# EAGLE design Logic Probe Ver.1 (EAGLE 9.6.2)
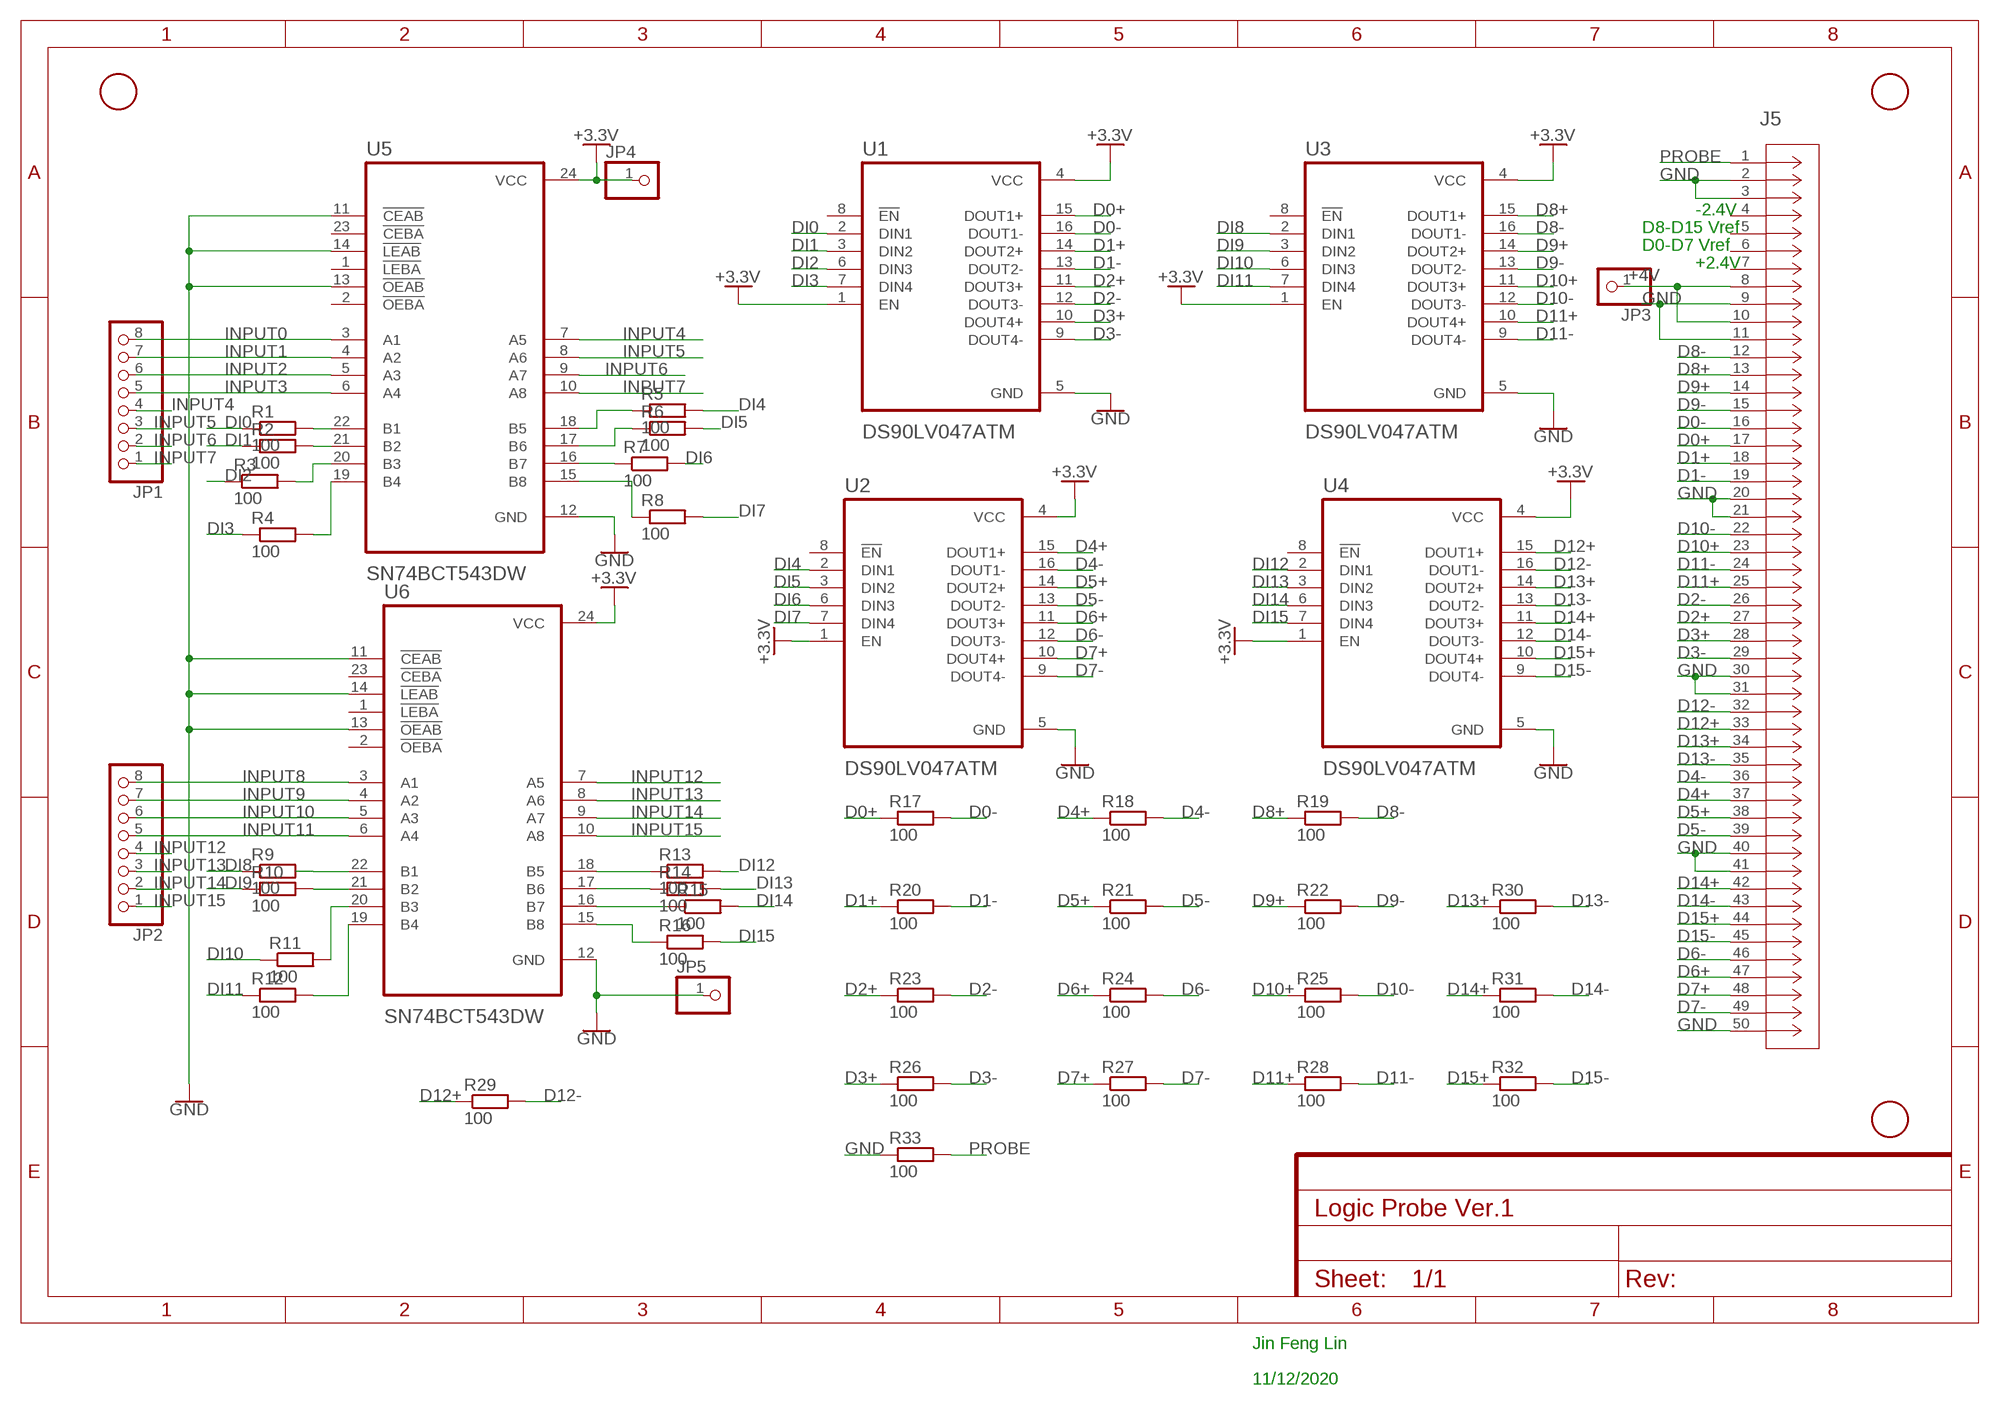
[diagram p0: schematic, sheet 1]

## Parts
J5  TST-125-01-G-D  [CONN_TST-125-XX-X-D_SAI]
JP1  PINHD-1X8LOCK  [1X08-LOCK]
JP2  PINHD-1X8LOCK  [1X08-LOCK]
JP3  PINHD-1X1  [1X01]
JP4  PINHD-1X1  [1X01]
JP5  PINHD-1X1  [1X01]
R1  100  R-EU_R0805  [R0805]
R2  100  R-EU_R0805  [R0805]
R3  100  R-EU_R0805  [R0805]
R4  100  R-EU_R0805  [R0805]
R5  100  R-EU_R0805  [R0805]
R6  100  R-EU_R0805  [R0805]
R7  100  R-EU_R0805  [R0805]
R8  100  R-EU_R0805  [R0805]
R9  100  R-EU_R0805  [R0805]
R10  100  R-EU_R0805  [R0805]
R11  100  R-EU_R0805  [R0805]
R12  100  R-EU_R0805  [R0805]
R13  100  R-EU_R0805  [R0805]
R14  100  R-EU_R0805  [R0805]
R15  100  R-EU_R0805  [R0805]
R16  100  R-EU_R0805  [R0805]
R17  100  R-EU_R0805  [R0805]
R18  100  R-EU_R0805  [R0805]
R19  100  R-EU_R0805  [R0805]
R20  100  R-EU_R0805  [R0805]
R21  100  R-EU_R0805  [R0805]
R22  100  R-EU_R0805  [R0805]
R23  100  R-EU_R0805  [R0805]
R24  100  R-EU_R0805  [R0805]
R25  100  R-EU_R0805  [R0805]
R26  100  R-EU_R0805  [R0805]
R27  100  R-EU_R0805  [R0805]
R28  100  R-EU_R0805  [R0805]
R29  100  R-EU_R0805  [R0805]
R30  100  R-EU_R0805  [R0805]
R31  100  R-EU_R0805  [R0805]
R32  100  R-EU_R0805  [R0805]
R33  100  R-EU_R0805  [R0805]
U1  DS90LV047ATM  [SOIC127P600X175-16N]
U2  DS90LV047ATM  [SOIC127P600X175-16N]
U3  DS90LV047ATM  [SOIC127P600X175-16N]
U4  DS90LV047ATM  [SOIC127P600X175-16N]
U5  SN74BCT543DW  [SOIC127P1030X265-24N]
U6  SN74BCT543DW  [SOIC127P1030X265-24N]
U$1  FIDUCIAL  [FIDUCIAL_1MM]
U$2  FIDUCIAL  [FIDUCIAL_1MM]
U$3  FIDUCIAL  [FIDUCIAL_1MM]

## Nets
+3.3V: JP4.1 U1.1(EN) U1.4(VCC) U2.1(EN) U2.4(VCC) U3.1(EN) U3.4(VCC) U4.1(EN) U4.4(VCC) U5.24(VCC) U6.24(VCC)
+4V: J5.8 J5.10 JP3.1
D0+: J5.17 R17.1 U1.15(DOUT1+)
D0-: J5.16 R17.2 U1.16(DOUT1-)
D1+: J5.18 R20.1 U1.14(DOUT2+)
D1-: J5.19 R20.2 U1.13(DOUT2-)
D2+: J5.27 R23.1 U1.11(DOUT3+)
D2-: J5.26 R23.2 U1.12(DOUT3-)
D3+: J5.28 R26.1 U1.10(DOUT4+)
D3-: J5.29 R26.2 U1.9(DOUT4-)
D4+: J5.37 R18.1 U2.15(DOUT1+)
D4-: J5.36 R18.2 U2.16(DOUT1-)
D5+: J5.38 R21.1 U2.14(DOUT2+)
D5-: J5.39 R21.2 U2.13(DOUT2-)
D6+: J5.47 R24.1 U2.11(DOUT3+)
D6-: J5.46 R24.2 U2.12(DOUT3-)
D7+: J5.48 R27.1 U2.10(DOUT4+)
D7-: J5.49 R27.2 U2.9(DOUT4-)
D8+: J5.13 R19.1 U3.15(DOUT1+)
D8-: J5.12 R19.2 U3.16(DOUT1-)
D9+: J5.14 R22.1 U3.14(DOUT2+)
D9-: J5.15 R22.2 U3.13(DOUT2-)
D10+: J5.23 R25.1 U3.11(DOUT3+)
D10-: J5.22 R25.2 U3.12(DOUT3-)
D11+: J5.25 R28.1 U3.10(DOUT4+)
D11-: J5.24 R28.2 U3.9(DOUT4-)
D12+: J5.33 R29.1 U4.15(DOUT1+)
D12-: J5.32 R29.2 U4.16(DOUT1-)
D13+: J5.34 R30.1 U4.14(DOUT2+)
D13-: J5.35 R30.2 U4.13(DOUT2-)
D14+: J5.42 R31.1 U4.11(DOUT3+)
D14-: J5.43 R31.2 U4.12(DOUT3-)
D15+: J5.44 R32.1 U4.10(DOUT4+)
D15-: J5.45 R32.2 U4.9(DOUT4-)
DI0: R1.1 U1.2(DIN1)
DI1: R2.1 U1.3(DIN2)
DI2: R3.1 U1.6(DIN3)
DI3: R4.1 U1.7(DIN4)
DI4: R5.2 U2.2(DIN1)
DI5: R6.2 U2.3(DIN2)
DI6: R7.2 U2.6(DIN3)
DI7: R8.2 U2.7(DIN4)
DI8: R9.1 U3.2(DIN1)
DI9: R10.1 U3.3(DIN2)
DI10: R11.1 U3.6(DIN3)
DI11: R12.1 U3.7(DIN4)
DI12: R13.2 U4.2(DIN1)
DI13: R14.2 U4.3(DIN2)
DI14: R15.2 U4.6(DIN3)
DI15: R16.2 U4.7(DIN4)
GND: J5.2 J5.3 J5.9 J5.11 J5.20 J5.21 J5.30 J5.31 J5.40 J5.41 J5.50 JP5.1 R33.1 U1.5(GND) U2.5(GND) U3.5(GND) U4.5(GND) U5.11(!CEAB) U5.12(GND) U5.13(!OEAB) U5.14(!LEAB) U6.11(!CEAB) U6.12(GND) U6.13(!OEAB) U6.14(!LEAB)
INPUT0: JP1.8 U5.3(A1)
INPUT1: JP1.7 U5.4(A2)
INPUT2: JP1.6 U5.5(A3)
INPUT3: JP1.5 U5.6(A4)
INPUT4: JP1.4 U5.7(A5)
INPUT5: JP1.3 U5.8(A6)
INPUT6: JP1.2 U5.9(A7)
INPUT7: JP1.1 U5.10(A8)
INPUT8: JP2.8 U6.3(A1)
INPUT9: JP2.7 U6.4(A2)
INPUT10: JP2.6 U6.5(A3)
INPUT11: JP2.5 U6.6(A4)
INPUT12: JP2.4 U6.7(A5)
INPUT13: JP2.3 U6.8(A6)
INPUT14: JP2.2 U6.9(A7)
INPUT15: JP2.1 U6.10(A8)
N$1: R12.2 U6.19(B4)
N$2: R11.2 U6.20(B3)
N$3: R10.2 U6.21(B2)
N$4: R9.2 U6.22(B1)
N$5: R13.1 U6.18(B5)
N$6: R14.1 U6.17(B6)
N$7: R15.1 U6.16(B7)
N$8: R16.1 U6.15(B8)
N$9: R4.2 U5.19(B4)
N$10: R3.2 U5.20(B3)
N$11: R2.2 U5.21(B2)
N$12: R1.2 U5.22(B1)
N$13: R5.1 U5.18(B5)
N$14: R6.1 U5.17(B6)
N$15: R7.1 U5.16(B7)
N$16: R8.1 U5.15(B8)
PROBE: J5.1 R33.2
Unconnected: J5.4 J5.5 J5.6 J5.7 U1.8(!EN) U2.8(!EN) U3.8(!EN) U4.8(!EN) U5.1(!LEBA) U5.2(!OEBA) U5.23(!CEBA) U6.1(!LEBA) U6.2(!OEBA) U6.23(!CEBA)

## Notes on the sheet
- -2.4V
- D8-D15 Vref
- D0-D7 Vref
- +2.4V
- Jin Feng Lin
- 11/12/2020

## Library data of the parts
J5 = 50pin:TST-125-01-G-D; BUILT_BY: EMA_Justin; COPYRIGHT: Copyright (C) 2018 Accelerated Designs. All rights reserved; DATASHEET: http://suddendocs.samtec.com/prints/tst-mkt.pdf; MANUFACTURER_PART_NUMBER: TST-125-01-G-D; SOURCELIBRARY: Samtec_2020-08-06_1; VENDOR: Samtec Inc
JP1 JP2 = adafruit:PINHD-1X8: PIN HEADER
JP3-JP5 = adafruit:PINHD-1X1: Pin header 1x1 for 0.1" spacing With round pins
R1-R33 = rcl:R-EU_: RESISTOR, European symbol; SPICEPREFIX: R
U1-U4 = DS90LV047ATM:DS90LV047ATM
U5 U6 = SN74BCT543DW:SN74BCT543DW: Check prices <https://pricing.snapeda.com/search/part/SN74BCT543DW/?ref=eda>; AVAILABILITY: Warning; DESCRIPTION: Octal Registered Transceivers 24-SOIC 0 to 70; MF: Texas Instruments; MP: SN74BCT543DW; PACKAGE: SOIC-24 Texas Instruments; PRICE: None; PURCHASE-URL: https://pricing.snapeda.com/search/part/SN74BCT543DW/?ref=eda
U$1-U$3 = adafruit:FIDUCIAL: For use by pick and place machines to calibrate the vision/machine, 1mm By microbuilder.eu

## Board
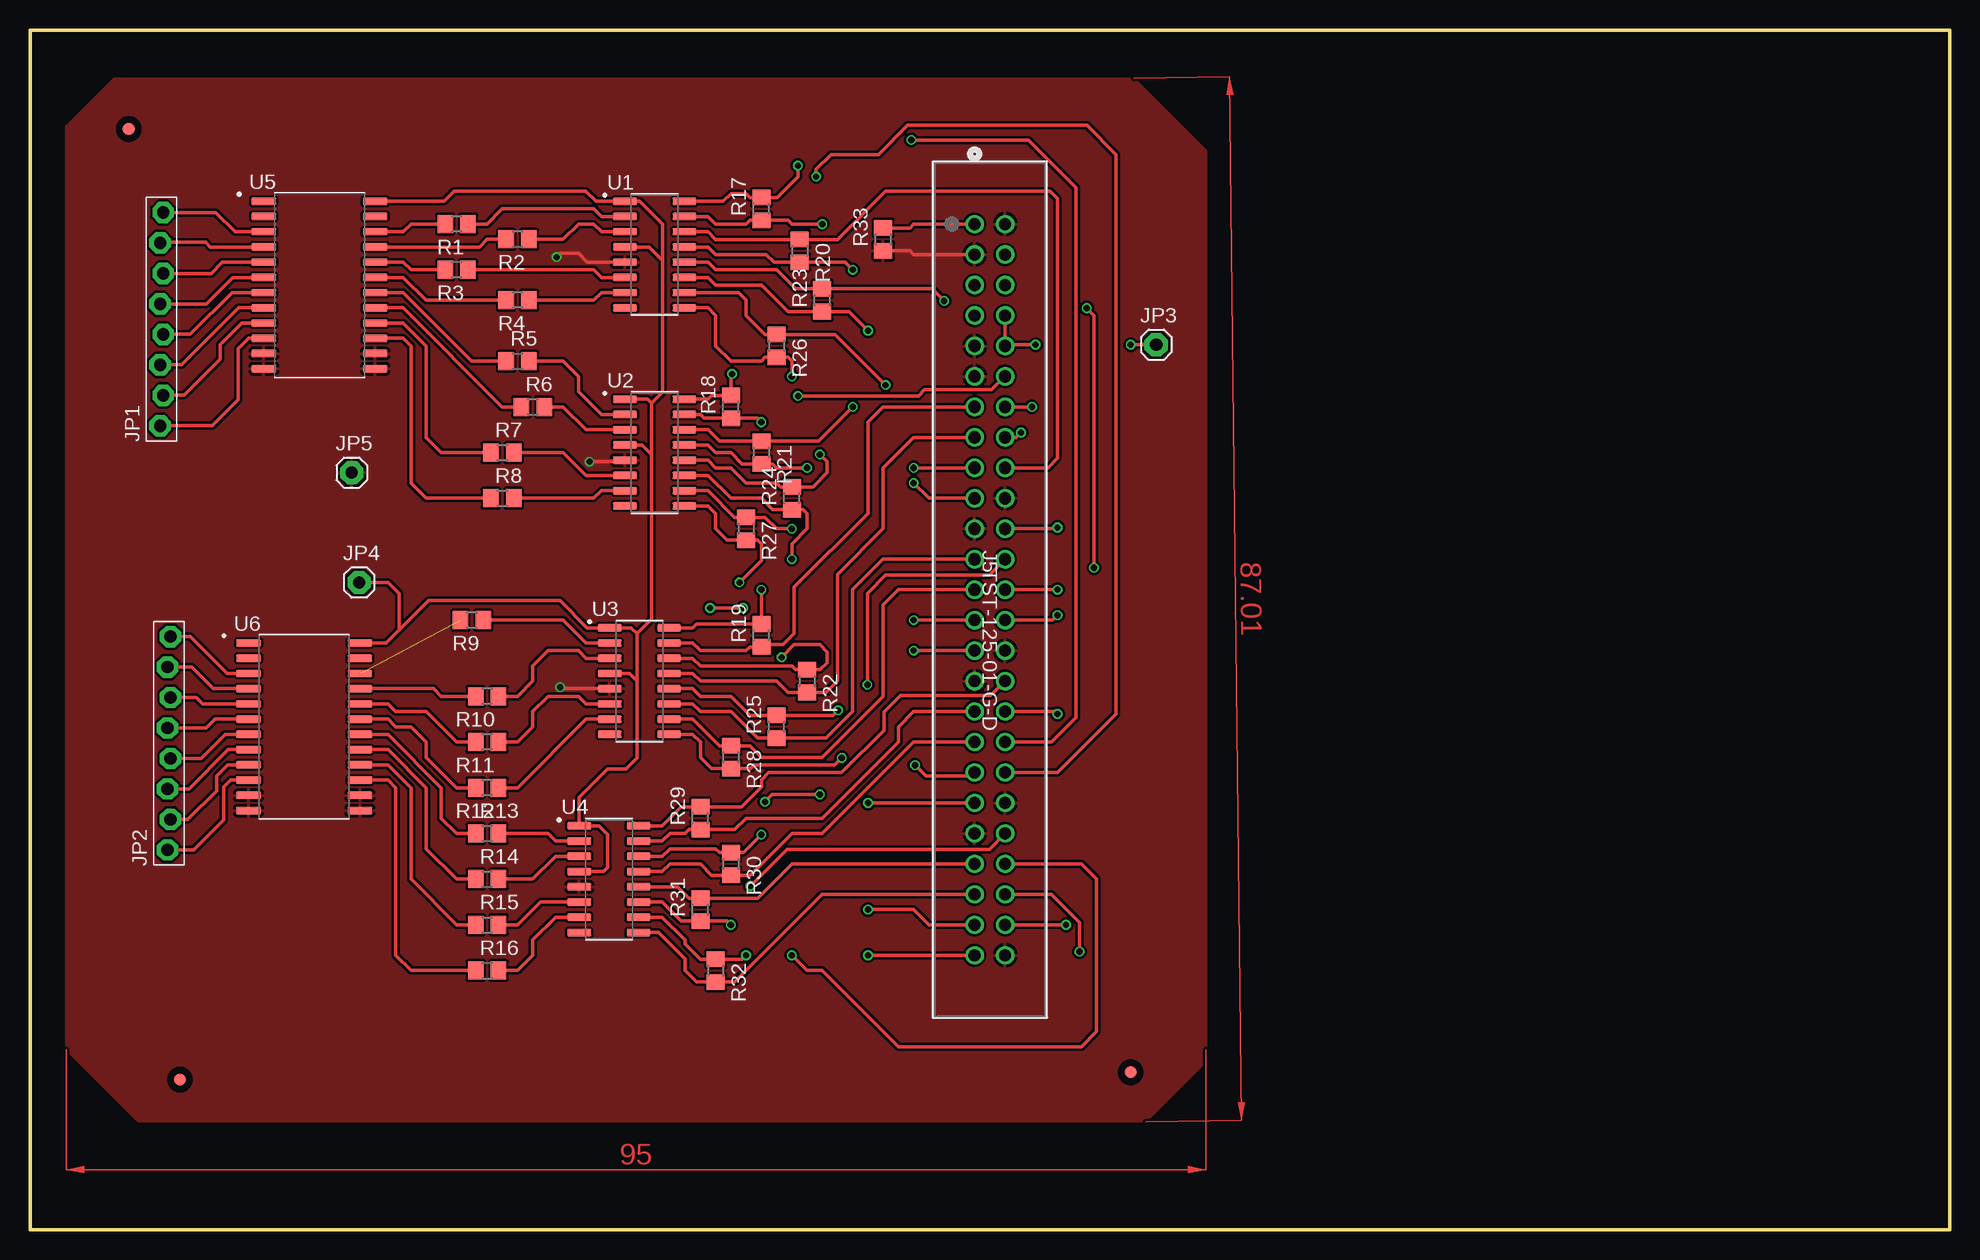
[diagram p1: board, top side]
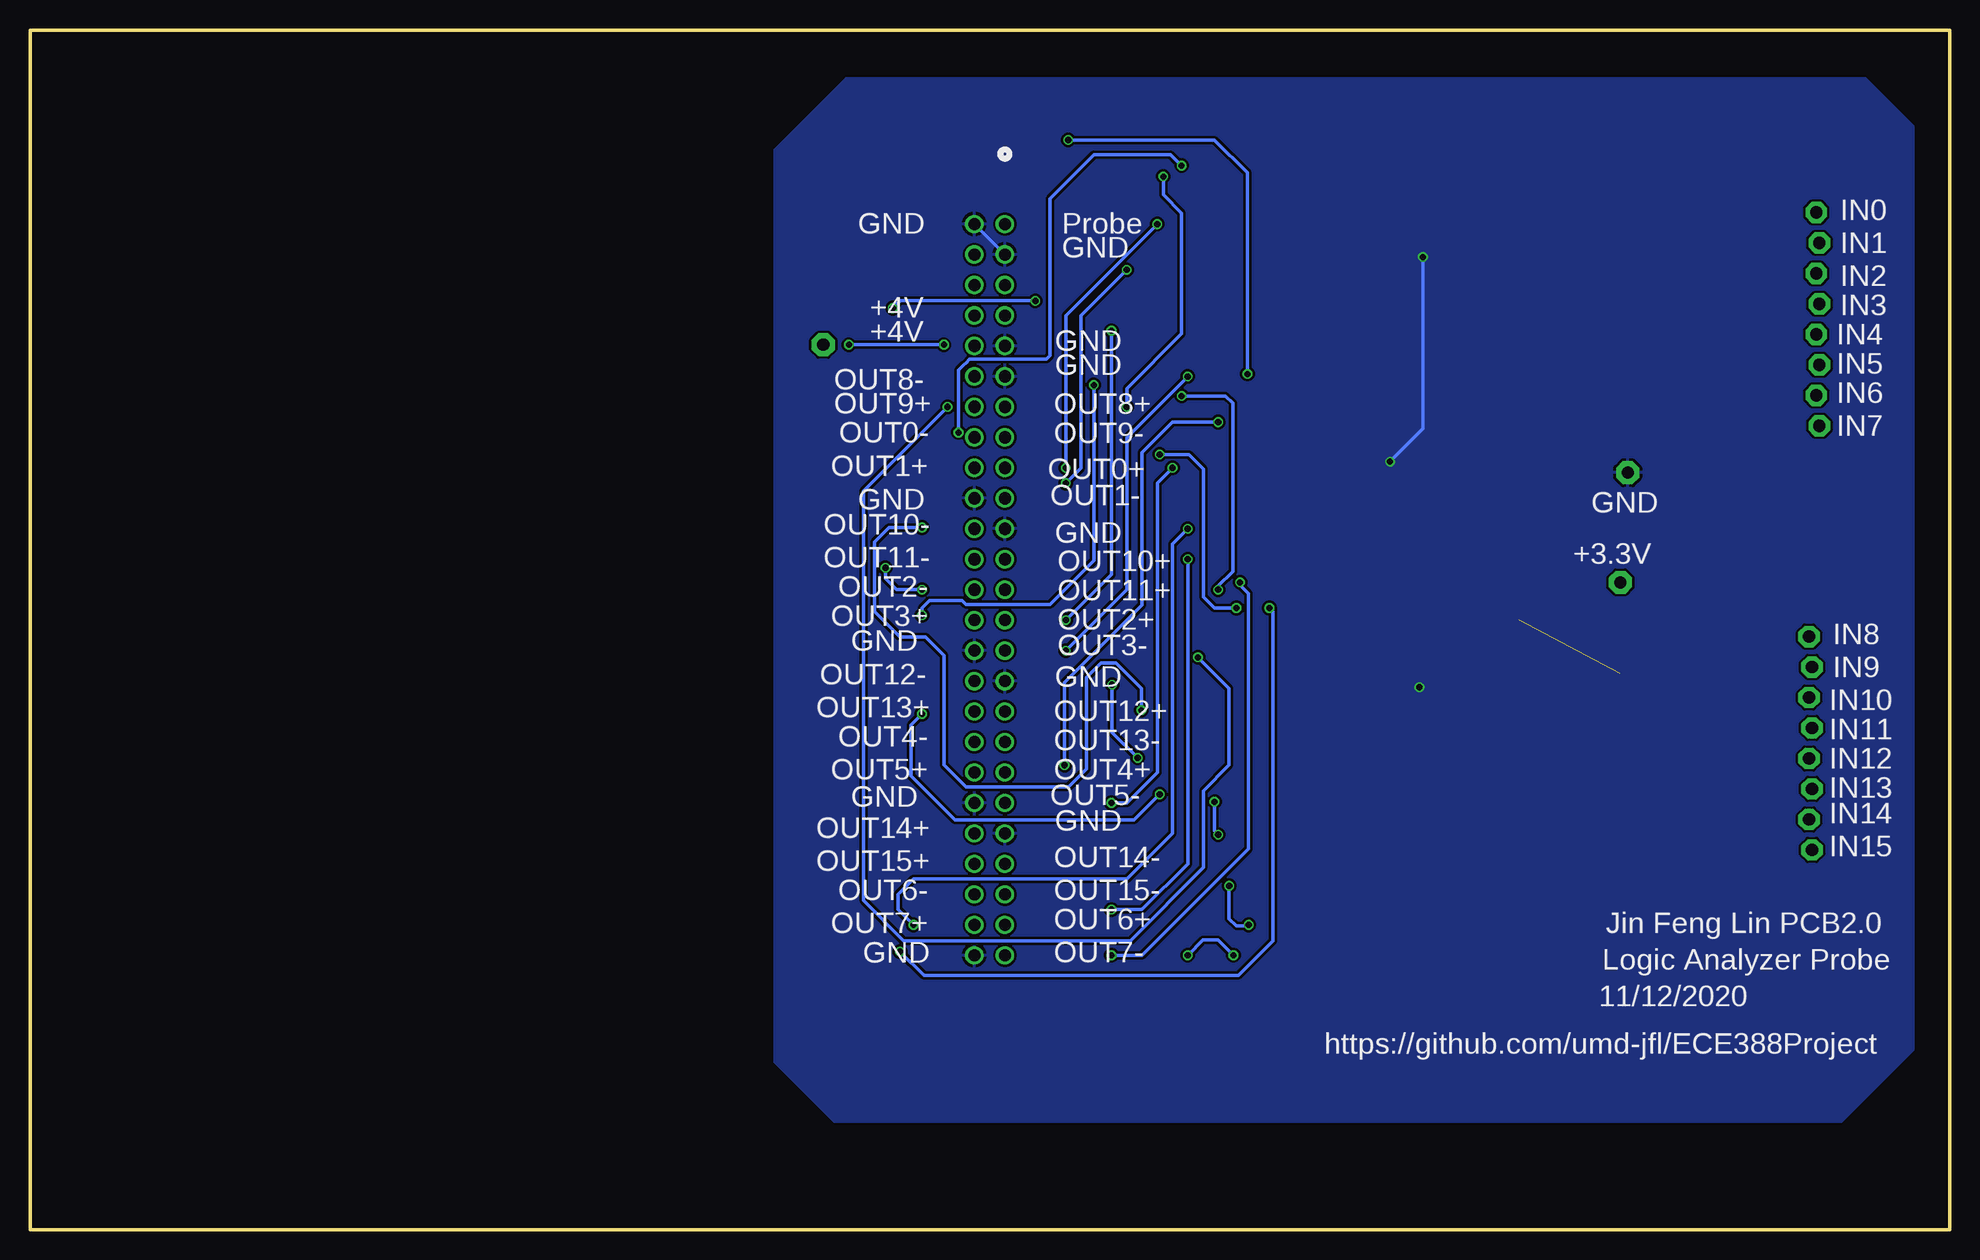
[diagram p2: board, bottom side, seen from below]

Size 160 x 100 mm. Coordinates in mm from the lower left corner, seen from the top.
Outline: 0,0 160,0 160,100 0,100 0,0
Copper layers (1*16): Top 0.035mm / dielectric 1.5mm / Bottom 0.035mm
Design rules "Dirty8TS": minimum track width 8mil, minimum drill 15mil, track to track 8mil, track to pad 8mil, pad to pad 8mil, via to via 8mil, smd to smd 0mil, copper to edge 10mil, drill to drill 10mil, minimum pad ring 10mil, minimum via ring 6mil, stop-mask expansion 2mil, vias tented up to drill 25mil, thermal gap 10mil

### Footprints (pad centres in the part's own frame; a part is rotated, then mirrored left to right if it is on the bottom)
CONN_TST-125-XX-X-D_SAI = drill 1.016 pad 1.524: 1 0,0; 2 0,2.54; 3 2.54,0; 4 2.54,2.54; 5 5.08,0; 6 5.08,2.54; 7 7.62,0; 8 7.62,2.54; 9 10.16,0; 10 10.16,2.54; 11 12.7,0; 12 12.7,2.54; 13 15.24,0; 14 15.24,2.54; 15 17.78,0; 16 17.78,2.54; 17 20.32,0; 18 20.32,2.54; 19 22.86,0; 20 22.86,2.54; 21 25.4,0; 22 25.4,2.54; 23 27.94,0; 24 27.94,2.54; 25 30.48,0; 26 30.48,2.54; 27 33.02,0; 28 33.02,2.54; 29 35.56,0; 30 35.56,2.54; 31 38.1,0; 32 38.1,2.54; 33 40.64,0; 34 40.64,2.54; 35 43.18,0; 36 43.18,2.54; 37 45.72,0; 38 45.72,2.54; 39 48.26,0; 40 48.26,2.54; 41 50.8,0; 42 50.8,2.54; 43 53.34,0; 44 53.34,2.54; 45 55.88,0; 46 55.88,2.54; 47 58.42,0; 48 58.42,2.54; 49 60.96,0; 50 60.96,2.54
1X08-LOCK = drill 1.016 pad 1.778 octagon: 1 -8.89,0.127; 2 -6.35,-0.127; 3 -3.81,0.127; 4 -1.27,-0.127; 5 1.27,0.127; 6 3.81,-0.127; 7 6.35,0.127; 8 8.89,-0.127
1X01 = drill 1.016 pad 1.93 octagon: 1 0,0
R0805 = smd 1.3 x 1.5: 1 -0.95,0; 2 0.95,0
SOIC127P600X175-16N = smd 1.97 x 0.6: 1 -2.475,4.445; 2 -2.475,3.175; 3 -2.475,1.905; 4 -2.475,0.635; 5 -2.475,-0.635; 6 -2.475,-1.905; 7 -2.475,-3.175; 8 -2.475,-4.445; 9 2.475,-4.445; 10 2.475,-3.175; 11 2.475,-1.905; 12 2.475,-0.635; 13 2.475,0.635; 14 2.475,1.905; 15 2.475,3.175; 16 2.475,4.445
SOIC127P1030X265-24N = smd 2.06 x 0.6: 1 -4.64,6.985; 2 -4.64,5.715; 3 -4.64,4.445; 4 -4.64,3.175; 5 -4.64,1.905; 6 -4.64,0.635; 7 -4.64,-0.635; 8 -4.64,-1.905; 9 -4.64,-3.175; 10 -4.64,-4.445; 11 -4.64,-5.715; 12 -4.64,-6.985; 13 4.64,-6.985; 14 4.64,-5.715; 15 4.64,-4.445; 16 4.64,-3.175; 17 4.64,-1.905; 18 4.64,-0.635; 19 4.64,0.635; 20 4.64,1.905; 21 4.64,3.175; 22 4.64,4.445; 23 4.64,5.715; 24 4.64,6.985
FIDUCIAL_1MM = smd 1 x 1: 1 0,0

### Placement (x,y rotation side)
J5  78.74,83.82 270 top
JP1  10.97,75.9 90 top
JP2  11.58,40.54 90 top
JP3  93.88,73.76 0 top
JP4  27.43,53.95 0 top
JP5  26.82,63.09 0 top
R1  35.56,83.82 180 top
R2  40.64,82.55 180 top
R3  35.56,80.01 180 top
R4  40.64,77.47 180 top
R5  40.64,72.39 0 top
R6  41.91,68.58 0 top
R7  39.37,64.77 0 top
R8  39.37,60.96 0 top
R9  36.83,50.8 180 top
R10  38.1,44.45 180 top
R11  38.1,40.64 180 top
R12  38.1,36.83 180 top
R13  38.1,33.02 0 top
R14  38.1,29.21 0 top
R15  38.1,25.4 0 top
R16  38.1,21.59 0 top
R17  60.96,85.09 90 top
R18  58.42,68.58 90 top
R19  60.96,49.53 90 top
R20  64.16,81.58 270 top
R21  60.96,64.77 270 top
R22  64.77,45.72 270 top
R23  66.04,77.47 90 top
R24  63.5,60.96 90 top
R25  62.23,41.91 90 top
R26  62.23,73.66 270 top
R27  59.69,58.42 270 top
R28  58.42,39.37 270 top
R29  55.88,34.29 90 top
R30  58.42,30.48 270 top
R31  55.88,26.67 90 top
R32  57.15,21.59 270 top
R33  71.12,82.55 90 top
U1  52.07,81.28 0 top
U2  52.07,64.77 0 top
U3  50.8,45.72 0 top
U4  48.26,29.21 0 top
U5  24.13,78.74 0 top
U6  22.86,41.91 0 top
U$1  91.74,13.11 0 top
U$2  8.23,91.74 0 top
U$3  12.5,12.5 0 top

### Tracks (layer width: path | path; a pad name or v marks a point on that pad's centre or on a via)
+3.3V
  Top 0.305: U4.4 47.83,29.84 48.16,30.18 48.16,32.92 47.42,33.66 U4.1 45.78,36.03 48.16,38.41 49.68,38.41 50.6,39.32 50.6,45.72 | U3.4 49.96,46.35 50.6,45.72 | 50.6,49.68 50.11,50.16 U3.1 46.46,50.16 44.2,52.43 33.22,52.43 30.79,49.99 | 50.6,49.68 50.6,45.72 | U2.4 51.03,65.41 51.82,64.62 | 51.82,64.62 51.82,50.9 50.6,49.68 | U2.1 51.49,69.22 51.82,68.89 | 51.82,68.89 51.82,64.62 | U1.4 51.59,81.92 52.73,80.77 | 51.82,68.89 52.73,69.8 52.73,80.77 | 52.73,80.77 52.73,83.82 50.83,85.72 U1.1 47.17,85.72 46.33,86.56 35.36,86.56 34.52,85.72 U5.24 | U6.24 29.69,48.9 30.79,49.99 | JP4.1 29.87,53.95 30.79,53.03 30.79,49.99
+4V  (via drill 0.51)
  Top 0.305: J5.8 J5.10 81.38,73.76 v83.82,73.76 | JP3.1 v91.75,73.76
  Bottom 0.305: v83.82,73.76 v91.75,73.76
D0+  (via drill 0.51)
  Top 0.305: U1.15 56.52,84.45 57.15,83.82 59.69,83.82 60.01,84.14 R17.1 63.18,84.14 63.5,83.82 v66.04,83.82 | J5.17 v73.66,63.5
  Bottom 0.305: v73.66,63.5 73.66,76.2 v66.04,83.82
D0-  (via drill 0.51)
  Top 0.305: U1.16 57.78,85.72 58.42,86.36 59.69,86.36 60.01,86.04 R17.2 62.27,86.04 64.01,87.78 v64.01,88.7 | J5.16 82.19,66.04 v82.6,66.45
  Bottom 0.305: v82.6,66.45 82.6,71.63 82.14,72.08 81.99,72.24 81.69,72.54 75.29,72.54 74.98,72.85 74.98,85.95 71.32,89.61 64.92,89.61 v64.01,88.7
D1+
  Top 0.305: U1.14 56.52,83.19 57.16,82.53 R20.1 67.3,82.53 71.32,86.56 85.04,86.56 85.65,85.95 85.65,64.31 84.84,63.5 J5.18
D1-  (via drill 0.51)
  Top 0.305: U1.13 56.52,81.92 57.15,81.28 61.37,81.28 62.01,80.64 R20.2 67.95,80.64 v68.58,80.01 | J5.19 74.93,60.96 v73.66,62.23
  Bottom 0.305: v68.58,80.01 72.39,76.2 72.39,63.5 v73.66,62.23
D2+  (via drill 0.51)
  Top 0.305: U1.11 56.52,79.38 57.15,78.74 60.96,78.74 63.18,76.52 R23.1 68.26,76.52 v69.85,74.93 | J5.27 v73.66,50.8
  Bottom 0.305: v73.66,50.8 69.85,54.61 v69.85,74.93
D2-  (via drill 0.51)
  Top 0.305: U1.12 56.52,80.64 57.15,80.01 62.23,80.01 63.82,78.42 R23.2 75.2,78.42 v76.2,77.42 | J5.26 v85.65,53.34 | v88.7,55.17 88.7,76.2 v88.09,76.81
  Bottom 0.305: v85.65,53.34 87.78,53.34 88.7,54.25 v88.7,55.17 | v88.09,76.81 87.48,77.42 v76.2,77.42
D3+  (via drill 0.51)
  Top 0.305: U1.10 59.05,78.11 59.69,77.47 59.69,76.2 61.28,74.61 R26.1 67.12,74.61 v71.32,70.41 | J5.28 85.24,50.8 v85.65,51.21
  Bottom 0.305: v71.32,70.41 71.32,55.78 74.83,52.27 74.98,52.12 81.99,52.12 82.3,52.43 85.04,52.43 85.65,51.82 v85.65,51.21
D3-  (via drill 0.51)
  Top 0.305: U1.9 56.52,76.83 57.15,76.2 57.15,73.66 58.42,72.39 60.96,72.39 61.28,72.71 R26.2 63.18,72.71 63.5,72.39 v63.5,71.12 | J5.29 v73.66,48.26
  Bottom 0.305: v63.5,71.12 68.58,66.04 68.58,53.34 v73.66,48.26
D4+  (via drill 0.51)
  Top 0.305: U2.15 55.88,67.94 56.2,67.63 R18.1 60.64,67.63 v60.96,67.31 | J5.37 78.44,37.8 74.68,37.8 v73.76,38.71
  Bottom 0.305: v60.96,67.31 64.77,67.31 67.31,64.77 67.31,52.07 73.56,45.82 73.66,45.72 73.76,45.62 v73.76,38.71
D4-  (via drill 0.51)
  Top 0.305: U2.16 56.52,69.22 56.83,69.53 R18.2 58.42,71.22 v58.52,71.32 | J5.36 85.14,40.64 87.17,42.67 87.17,86.87 83.21,90.83 v73.46,90.83
  Bottom 0.305: v73.46,90.83 61.27,90.83 58.52,88.09 v58.52,71.32
D5+  (via drill 0.51)
  Top 0.305: U2.14 56.52,66.67 57.47,65.72 R21.1 65.72,65.72 v68.58,68.58 | J5.38 85.65,38.1 90.53,42.98 90.53,89.61 88.09,92.05 73.15,92.05 70.71,89.61 66.75,89.61 65.53,88.39 v65.53,87.78
  Bottom 0.305: v65.53,87.78 65.53,86.26 64.01,84.73 64.01,74.68 68.58,70.1 v68.58,68.58
D5-  (via drill 0.51)
  Top 0.305: U2.13 56.52,65.41 57.15,64.77 58.42,64.77 59.37,63.82 R21.2 61.91,63.82 62.23,63.5 v64.77,63.5 | J5.39 v69.85,35.56
  Bottom 0.305: v69.85,35.56 68.58,35.56 66.04,38.1 66.04,62.23 v64.77,63.5
D6+  (via drill 0.51)
  Top 0.305: U2.11 56.52,62.87 58.42,60.96 60.96,60.96 61.91,60.01 R24.1 64.45,60.01 64.77,59.69 64.77,58.42 63.5,57.15 v63.5,55.88 | J5.47 74.93,25.4 73.66,26.67 v69.85,26.67
  Bottom 0.305: v69.85,26.67 67.31,26.67 63.5,30.48 63.5,31.7 v63.5,55.88
D6-  (via drill 0.51)
  Top 0.305: U2.12 56.52,64.14 57.15,63.5 58.42,63.5 59.69,62.23 62.23,62.23 62.55,61.91 R24.2 65.26,61.91 66.45,63.09 66.45,64.01 v65.84,64.62 | v59.44,51.82 v56.69,51.82 | J5.46 85.14,27.94 87.48,25.6 v87.48,23.16
  Bottom 0.305: v65.84,64.62 63.4,64.62 62.18,63.4 62.18,52.73 61.27,51.82 v59.44,51.82 | v56.69,51.82 56.39,51.51 56.39,24.08 59.28,21.18 85.5,21.18 v87.48,23.16
D7+  (via drill 0.51)
  Top 0.305: U2.10 56.52,61.59 58.74,59.37 R27.1 61.28,59.37 62.23,58.42 v63.5,58.42 | J5.48 v86.36,25.4
  Bottom 0.305: v86.36,25.4 87.63,26.67 87.63,27.94 86.36,29.21 68.58,29.21 64.77,33.02 64.77,57.15 v63.5,58.42
D7-  (via drill 0.51)
  Top 0.305: U2.9 56.52,60.33 57.15,59.69 57.15,58.42 58.1,57.47 R27.2 60.64,57.47 60.96,57.15 60.96,55.78 v59.13,53.95 | v69.85,22.86 J5.49
  Bottom 0.305: v69.85,22.86 67.31,22.86 58.42,31.75 58.42,53.03 59.13,53.75 v59.13,53.95
D8+
  Top 0.305: U3.15 55.24,48.9 55.88,48.26 59.69,48.26 60.01,48.58 R19.1 61.15,48.77 62.79,48.77 63.7,49.68 63.7,53.54 69.85,59.69 69.85,67.31 71.12,68.58 J5.13
D8-  (via drill 0.51)
  Top 0.305: U3.16 55.24,50.16 55.56,50.48 R19.2 v60.96,53.34 | v64.01,69.49 74.07,69.49 74.57,70 80.16,70 J5.12
  Bottom 0.305: v64.01,69.49 60.35,69.49 59.74,68.89 59.74,54.86 60.96,53.65 v60.96,53.34
D9+  (via drill 0.51)
  Top 0.305: U3.14 55.24,47.62 55.88,46.99 63.5,46.99 63.82,46.67 R22.1 65.87,46.67 66.45,47.24 66.45,48.16 65.84,48.77 63.7,48.77 v62.64,47.7 | J5.14 v83.52,68.58
  Bottom 0.305: v62.64,47.7 60.05,45.11 60.05,38.71 62.18,36.58 62.18,30.18 68.28,24.08 87.17,24.08 90.53,27.43 90.53,61.57 v83.52,68.58
D9-
  Top 0.305: U3.13 55.24,46.35 55.88,45.72 62.23,45.72 63.18,44.77 R22.2 66.36,44.77 67.31,45.72 67.31,54.61 71.12,58.42 71.12,63.5 73.66,66.04 J5.15
D10+
  Top 0.305: U3.11 55.24,43.81 55.88,43.18 58.42,43.18 60.64,40.96 R25.1 66.36,40.96 68.58,43.18 68.58,53.34 71.12,55.88 J5.23
D10-  (via drill 0.51)
  Top 0.305: U3.12 55.24,45.09 55.88,44.45 58.42,44.45 60.01,42.86 R25.2 66.94,42.86 v67.36,43.28 | J5.22 85.55,58.42 v85.65,58.52
  Bottom 0.305: v67.36,43.28 67.36,45.11 69.49,47.24 70.71,47.24 71.93,46.02 71.93,38.41 73.46,36.88 81.99,36.88 83.82,38.71 83.82,47.85 85.34,49.38 87.48,49.38 89.61,51.51 89.61,57.3 88.39,58.52 v85.65,58.52
D11+
  Top 0.305: U3.10 55.24,42.55 57.47,40.32 R28.1 60.01,40.32 60.96,39.37 66.04,39.37 71.12,44.45 71.12,52.07 72.39,53.34 J5.25
D11-  (via drill 0.51)
  Top 0.305: U3.9 55.24,41.27 55.88,40.64 55.88,39.37 56.83,38.42 R28.2 60.06,38.42 60.35,38.71 67.06,38.71 v67.67,39.32 | J5.24 79.96,54.56 71.32,54.56 69.8,53.03 v69.8,45.41
  Bottom 0.305: v69.8,45.41 69.8,41.45 v67.67,39.32
D12+
  Top 0.305: U4.15 52.7,32.38 53.34,33.02 54.61,33.02 54.93,33.34 R29.1 58.74,33.34 59.69,34.29 66.04,34.29 72.39,40.64 72.39,41.91 73.66,43.18 J5.33
D12-
  Top 0.305: U4.16 52.7,33.66 54.29,35.24 R29.2 59.32,35.24 60.96,36.88 60.96,37.49 61.57,38.1 67.67,38.1 71.17,41.6 71.17,43.13 72.54,44.5 80.06,44.5 J5.32
D13+  (via drill 0.51)
  Top 0.305: U4.14 52.7,31.11 53.34,31.75 57.15,31.75 57.47,31.43 R30.1 59.47,31.43 v60.96,32.92 | J5.34 85.45,43.18 v85.65,42.98 | v65.84,36.27 61.87,36.27 v61.27,35.66
  Bottom 0.305: v85.65,42.98 86.56,42.06 86.56,37.8 82.91,34.14 67.97,34.14 v65.84,36.27 | v61.27,35.66 61.27,33.22 v60.96,32.92
D13-
  Top 0.305: U4.13 52.7,29.84 53.34,30.48 55.88,30.48 56.83,29.53 R30.2 60.01,29.53 63.5,33.02 66.04,33.02 73.66,40.64 J5.35
D14+  (via drill 0.51)
  Top 0.305: U4.11 52.7,27.3 54.29,25.72 R31.1 58.1,25.72 v58.42,25.4 | J5.42 79.96,31.7 63.09,31.7 v60.05,28.65
  Bottom 0.305: v58.42,25.4 58.52,25.3 59.44,25.3 60.05,25.91 v60.05,28.65
D14-
  Top 0.305: U4.12 53.98,28.57 54.93,27.62 R31.2 60.64,27.62 63.5,30.48 J5.43
D15+  (via drill 0.51)
  Top 0.305: U4.10 52.7,26.04 54.61,24.13 54.61,23.81 55.88,22.54 R32.1 59.37,22.54 v59.69,22.86 | v63.5,22.86 64.77,21.59 66.04,21.59 69.85,17.78 72.39,15.24 87.63,15.24 88.9,16.51 88.9,29.21 87.63,30.48 J5.44
  Bottom 0.305: v59.69,22.86 60.96,24.13 62.23,24.13 v63.5,22.86
D15-
  Top 0.305: U4.9 52.4,24.77 54.61,22.55 54.61,21.59 55.56,20.64 R32.2 58.74,20.64 66.04,27.94 J5.45
DI0
  Top 0.305: R1.1 38.1,83.82 39.37,85.09 46.99,85.09 47.62,84.45 U1.2
DI1
  Top 0.305: U1.3 47.62,83.19 46.99,83.82 45.72,83.82 44.45,82.55 R2.1
DI2
  Top 0.305: U1.6 47.62,79.38 46.99,80.01 R3.1
DI3
  Top 0.305: U1.7 47.62,78.11 46.99,77.47 R4.1
DI4
  Top 0.305: U2.2 47.62,67.94 45.72,69.85 45.72,71.12 44.45,72.39 R5.2
DI5
  Top 0.305: R6.2 44.45,68.58 46.35,66.67 U2.3
DI6
  Top 0.305: U2.6 46.35,62.87 44.45,64.77 R7.2
DI7
  Top 0.305: U2.7 47.62,61.59 46.99,60.96 R8.2
DI8
  Top 0.305: U3.2 46.35,48.9 44.45,50.8 R9.1
DI9
  Top 0.305: U3.3 46.35,47.62 45.72,48.26 43.18,48.26 41.91,46.99 41.91,45.72 40.64,44.45 R10.1
DI10
  Top 0.305: U3.6 46.35,43.81 45.72,44.45 43.18,44.45 41.91,43.18 41.91,41.91 40.64,40.64 R11.1
DI11
  Top 0.305: U3.7 46.35,42.55 40.64,36.83 R12.1
DI12
  Top 0.305: U4.2 43.81,32.38 43.18,33.02 R13.2
DI13
  Top 0.305: U4.3 43.81,31.11 41.91,29.21 R14.2
DI14
  Top 0.305: U4.6 42.55,27.3 40.64,25.4 R15.2
DI15
  Top 0.305: U4.7 43.81,26.04 41.91,24.13 41.91,22.86 40.64,21.59 R16.2
GND  (via drill 0.51)
  Top 0.305: R33.1 73.34,81.6 73.66,81.28 J5.3 | U1.5 46.46,80.64 45.72,81.38 44.2,81.38 v43.89,81.08 | U2.5 49.47,64.01 v46.63,64.01 | U3.5 44.22,45.09 44.2,45.11 v44.2,45.21
  Bottom 0.305: J5.3 J5.2 | v43.89,81.08 43.89,66.75 v46.63,64.01
  pour Top (isolate 0.02): 3,92 7,96 8,96 92,96 98,90 98,14 93,9 9,9 4,14 3,15
  pour Bottom (isolate 0.02): 3,92 7,96 92,96 98,90 98,14 93,9 9,9 3,15
INPUT0
  Top 0.305: U5.3 17.09,83.19 15.49,84.78 JP1.8
INPUT1
  Top 0.305: U5.4 15.01,81.92 14.63,82.3 10.9,82.3 JP1.7
INPUT2
  Top 0.305: U5.5 16.03,80.64 15.09,79.7 JP1.6
INPUT3
  Top 0.305: U5.6 16.89,79.38 14.68,77.17 JP1.5
INPUT4
  Top 0.305: U5.7 16.84,78.11 13.36,74.62 JP1.4
INPUT5
  Top 0.305: U5.8 17.4,76.83 12.65,72.08 JP1.3
INPUT6
  Top 0.305: U5.9 17.65,75.56 15.85,73.76 15.85,72.54 12.85,69.55 JP1.2
INPUT7
  Top 0.305: U5.10 18.21,74.3 17.37,73.46 17.37,69.19 15.19,67 JP1.1
INPUT8
  Top 0.305: JP2.8 13.36,49.43 16.43,46.35 U6.3
INPUT9
  Top 0.305: JP2.7 13.46,46.89 15.27,45.09 U6.4
INPUT10
  Top 0.305: U6.5 14.4,43.81 13.87,44.35 JP2.6
INPUT11
  Top 0.305: U6.6 15.42,42.55 14.68,41.81 JP2.5
INPUT12
  Top 0.305: U6.7 16.28,41.27 14.28,39.27 JP2.4
INPUT13
  Top 0.305: U6.8 16.54,40.01 13.26,36.73 JP2.3
INPUT14
  Top 0.305: JP2.2 13.16,34.19 15.54,36.58 15.54,37.8 16.46,38.71 18.2,38.71 U6.9
INPUT15
  Top 0.305: U6.10 16.74,37.47 16.15,36.88 16.15,34.14 13.66,31.65 JP2.1
N$1
  Top 0.305: U6.19 29.84,42.55 30.48,41.91 31.75,41.91 33.02,40.64 33.02,39.37 35.56,36.83 R12.2
N$2
  Top 0.305: U6.20 29.84,43.81 30.48,43.18 33.02,43.18 35.56,40.64 R11.2
N$3
  Top 0.305: U6.21 33.66,45.09 34.29,44.45 R10.2
N$4  (1 unrouted)
N$5
  Top 0.305: U6.18 29.84,41.27 34.29,36.83 34.29,34.29 35.56,33.02 R13.1
N$6
  Top 0.305: U6.17 29.84,40.01 33.02,36.83 33.02,31.75 35.56,29.21 R14.1
N$7
  Top 0.305: U6.16 29.84,38.73 31.75,36.83 31.75,29.21 35.56,25.4 R15.1
N$8
  Top 0.305: U6.15 29.84,37.47 30.48,36.83 30.48,22.86 31.75,21.59 R16.1
N$9
  Top 0.305: U5.19 31.11,79.38 33.02,77.47 R4.2
N$10
  Top 0.305: U5.20 31.11,80.64 31.75,80.01 R3.2
N$11
  Top 0.305: U5.21 37.47,81.92 38.1,82.55 R2.2
N$12
  Top 0.305: U5.22 31.11,83.19 31.75,83.82 R1.2
N$13
  Top 0.305: U5.18 31.11,78.11 36.83,72.39 R5.1
N$14
  Top 0.305: U5.17 31.11,76.83 39.37,68.58 R6.1
N$15
  Top 0.305: U5.16 31.11,75.56 33.02,73.66 33.02,66.04 34.29,64.77 R7.1
N$16
  Top 0.305: U5.15 31.11,74.3 31.75,73.66 31.75,62.23 33.02,60.96 R8.1
PROBE
  Top 0.305: R33.2 73.34,83.5 73.66,83.82 J5.1
(copper drawn outside any net)
  shapes: Top area x2

### Text on the board
bPlace: IN0 | Probe | GND | IN1 | GND | IN2 | IN3 | +4V | GND | IN4 | +4V | GND | IN5 | OUT8- | IN6 | OUT8+ | OUT9+ | OUT0- | IN7 | OUT9- | OUT0+ | OUT1+ | GND | OUT1- | GND | GND | OUT10- | +3.3V | OUT10+ | OUT11- | OUT2- | OUT11+ | OUT2+ | GND | OUT3+ | IN8 | OUT3- | GND | IN9 | OUT12- | IN10 | OUT13+ | OUT12+ | IN11 | OUT13- | OUT4- | IN12 | OUT4+ | GND | OUT5+ | IN13 | GND | OUT5- | IN14 | OUT14+ | IN15 | OUT14- | OUT15+ | OUT15- | OUT6- | Jin Feng Lin PCB2.0 | OUT6+ | OUT7+ | GND | Logic Analyzer Probe | OUT7- | 11/12/2020 | https://github.com/umd-jfl/ECE388Project